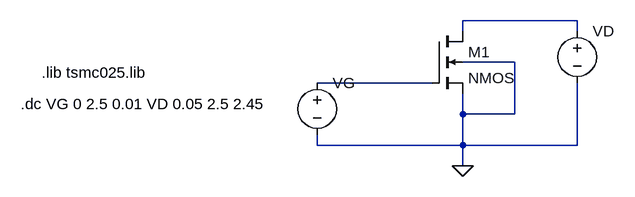
[diagram p0: schematic 250n_IDVG.asc]
250n_IDVG.asc, the LTspice schematic file:
Version 4
SHEET 1 880 680
WIRE 416 112 240 112
WIRE 240 128 240 112
WIRE 416 128 416 112
WIRE 320 176 240 176
WIRE 192 208 16 208
WIRE 240 256 240 224
WIRE 320 256 320 176
WIRE 320 256 240 256
WIRE 16 304 16 288
WIRE 240 304 240 256
WIRE 240 304 16 304
WIRE 416 304 416 208
WIRE 416 304 240 304
WIRE 240 336 240 304
FLAG 240 336 0
SYMBOL nmos4 192 128 R0
SYMATTR InstName M1
SYMATTR Value2 l=240n w=360n
SYMBOL voltage 16 192 R0
WINDOW 123 0 0 Left 0
WINDOW 39 0 0 Left 0
SYMATTR InstName VG
SYMATTR Value ""
SYMBOL voltage 416 112 R0
WINDOW 123 0 0 Left 0
WINDOW 39 0 0 Left 0
SYMATTR InstName VD
SYMATTR Value ""
TEXT -408 192 Left 2 !.lib tsmc025.lib
TEXT -440 240 Left 2 !.dc VG 0 2.5 0.01 VD 0.05 2.5 2.45

The netlist it stands for:
* 250n_IDVG.asc
M1 N001 N002 0 0 NMOS l=240n w=360n
VG N002 0
VD N001 0
.model NMOS NMOS
.model PMOS PMOS
.lib standard.mos
.lib tsmc025.lib
.dc VG 0 2.5 0.01 VD 0.05 2.5 2.45
.backanno
.end